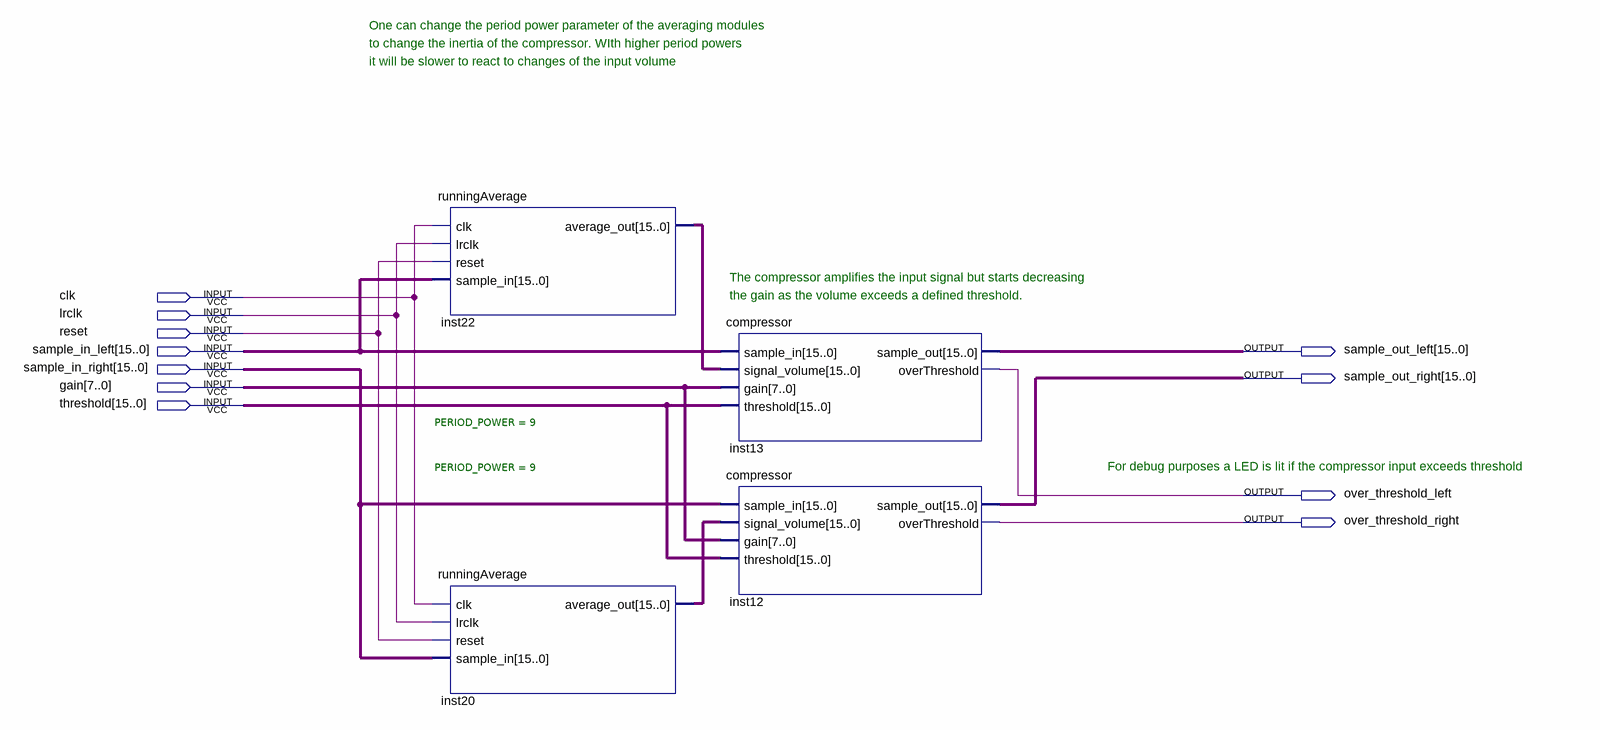
[diagram p0: schematic sheet]
// Quartus schematic compressor_block.bdf as structural Verilog: 4 symbols, 11 pins
module compressor_block (
  input  clk,
  input  lrclk,
  input  reset,
  input  [15:0] sample_in_left,
  input  [15:0] sample_in_right,
  input  [7:0] gain,
  input  [15:0] threshold,
  output [15:0] sample_out_left,
  output [15:0] sample_out_right,
  output over_threshold_left,
  output over_threshold_right
);

  wire [15:0] inst20_average_out, inst22_average_out;

  runningAverage #(.PERIOD_POWER(9)) inst22 (
    .clk(clk), .lrclk(lrclk), .reset(reset), .sample_in(sample_in_left), .average_out(inst22_average_out));
  runningAverage #(.PERIOD_POWER(9)) inst20 (
    .clk(clk), .lrclk(lrclk), .reset(reset), .sample_in(sample_in_right), .average_out(inst20_average_out));
  compressor inst13 (
    .sample_in(sample_in_left), .signal_volume(inst22_average_out), .gain(gain), .threshold(threshold),
    .sample_out(sample_out_left), .overThreshold(over_threshold_left));
  compressor inst12 (
    .sample_in(sample_in_right), .signal_volume(inst20_average_out), .gain(gain), .threshold(threshold),
    .sample_out(sample_out_right), .overThreshold(over_threshold_right));

  // Notes on the sheet:
  //   One can change the period power parameter of the averaging modules
  //   to change the inertia of the compressor. WIth higher period powers
  //   it will be slower to react to changes of the input volume
  //   The compressor amplifies the input signal but starts decreasing
  //   the gain as the volume exceeds a defined threshold.
  //   For debug purposes a LED is lit if the compressor input exceeds threshold
endmodule
